# EasyEDA Pro project ProjectFile.epro

# Schematic Schematic1
Board Name: Board1; Create Date: 2026-05-28; Page Name: P1; Project Name: Compact Devboard; Schematic Name: Schematic1; Update Date: 2026-05-31; Company: EasyEDA.com; Page Size: A4; Version: V1.0
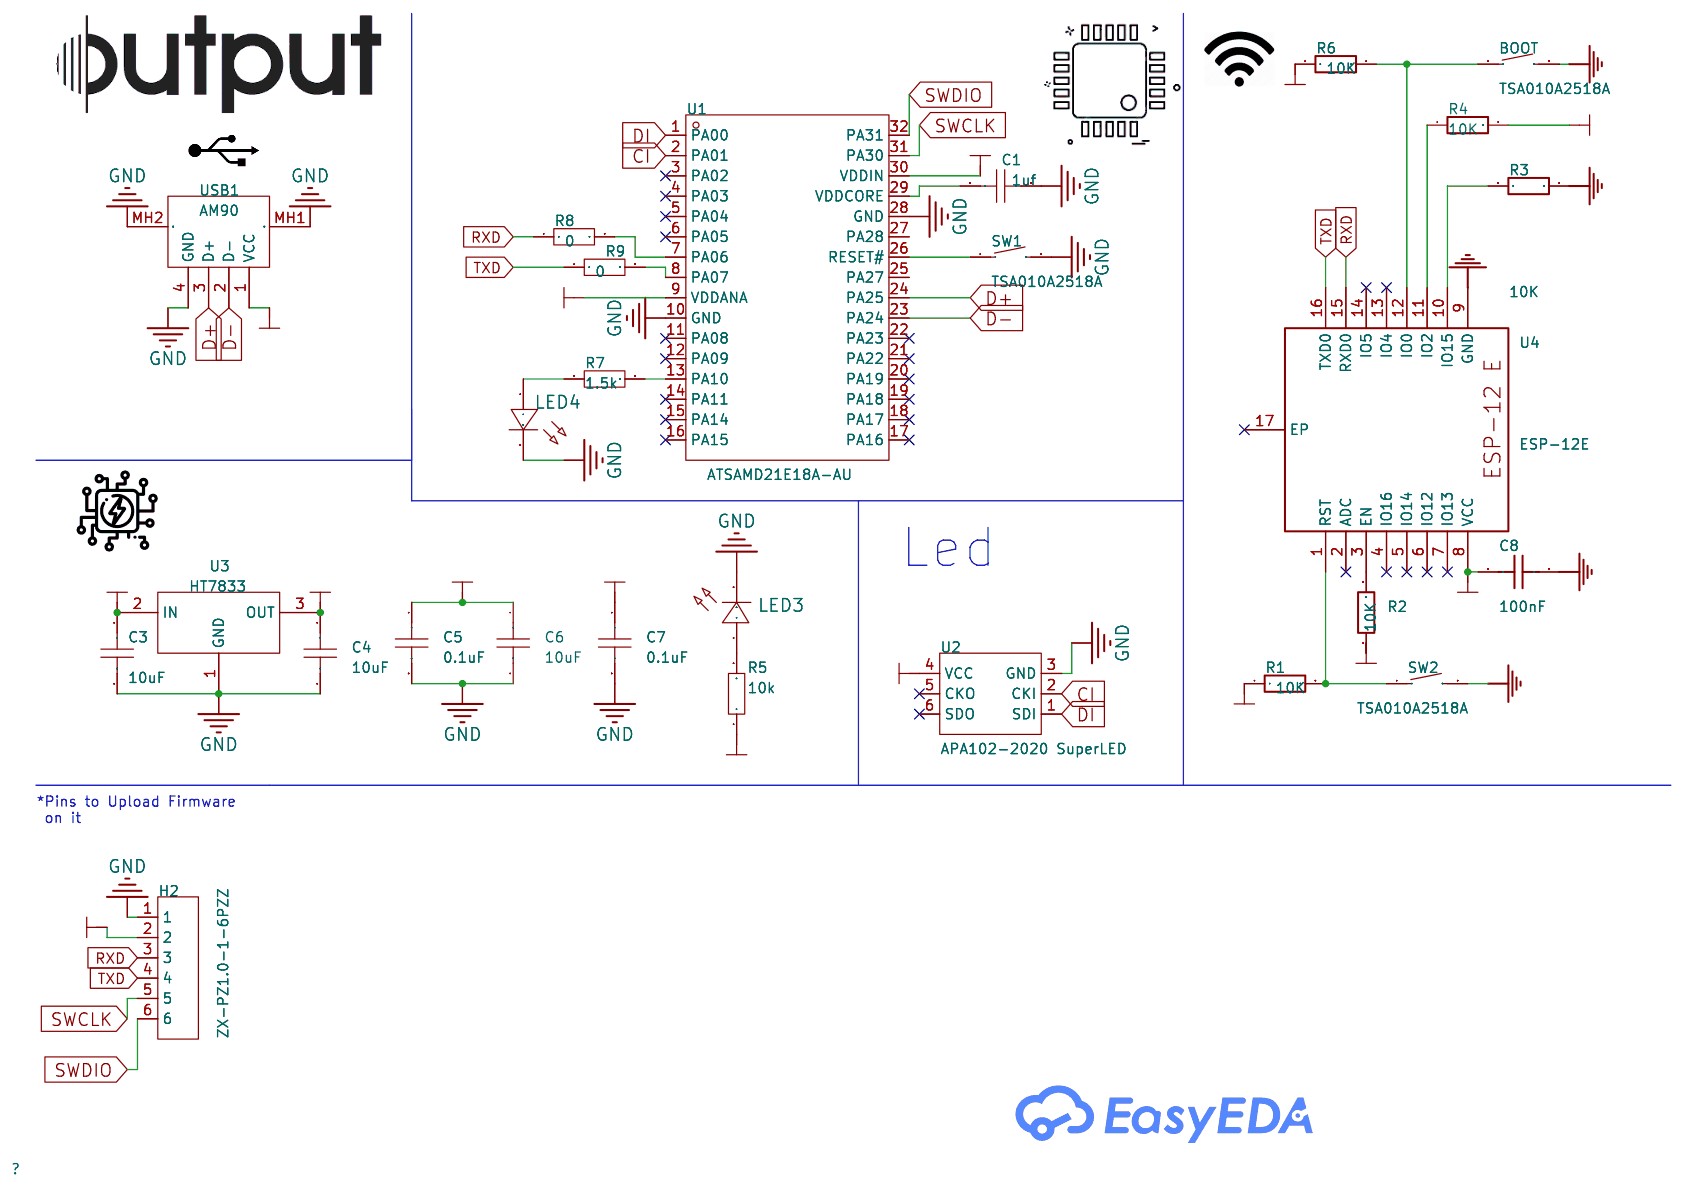
[diagram p0: schematic sheet]

## Parts
BOOT  TSA010A2518A  [SW-SMD_L4.0-W3.0-LS5.0]
C1  1uf  [C0603]
C3  10uF  [C0805]
C4  10uF  [C0805]
C5  0.1uF  [C0805]
C6  10uF  [C0805]
C7  0.1uF  [C0805]
C8  100nF  [C0805]
H2  ZX-PZ1.0-1-6PZZ  [HDR-TH_6P-P1.00-V-F]
LED3  -  [LED0805-RD_GREEN_C0805YGC]
LED4  -  [LED0805-RD_GREEN_C0805YGC]
R1  10K  [R0805]
R2  10K  [R0805]
R3  10K  [R0805]
R4  10K  [R0805]
R5  10k  [R0805_NEW]
R6  10K  [R0805]
R7  1.5k  [R0805_NEW]
R8  0  [R0603]
R9  0  [R0603]
SW1  TSA010A2518A  [SW-SMD_L4.0-W3.0-LS5.0]
SW2  TSA010A2518A  [SW-SMD_L4.0-W3.0-LS5.0]
U1  ATSAMD21E18A-AU  [TQFP-32_L7.0-W7.0-P0.80-LS9.0-BL]
U2  APA102-2020 SuperLED  [LED-SMD_6P-L2.0-W2.0-APA102-2020-SUPERLED]
U3  HT7833  [SOT-89_L4.5-W2.5-P1.50-LS4.2-BR]
U4  ESP-12E  [WIRELM-SMD_ESP-12S]
USB1  AM90  [USB-AM-TH_AM90]

## Library data of the parts
BOOT SW1 SW2 = TSA010A2518A: Actuator Style:Round Button Operating Force:1.8N Mounting Type:Surface Mount,Vertical Length:3.9mm Width:3mm Switch Height:2.5mm Contact Current:50mA Voltage Rating:12V Life:-; LCSC Part Name: 3*4*2.5H-J 180gf 双弹平脚; Supplier Part: C2888945; Manufacturer: BZCN(博众电气); Supplier Footprint: SMD,3.9x3mm; JLCPCB Part Class: Extended Part; Datasheet: https://item.szlcsc.com/datasheet/TSA010A2518A/3109348.html; Supplier: LCSC; Actuator Style: Round Button; Operating Force: 1.8N; Mounting Type: Surface Mount,Vertical; Length: 3.9mm; Width: 3mm; Switch Height: 2.5mm; Contact Current: 50mA; Voltage Rating: 12V
C1 C3-C7 = CAP_0603: Supplier Footprint: 0603
C8 = 100nF: Supplier: LCSC; Supplier Part: C141183; Manufacturer: KEMET; Manufacturer Part: C1206C104K1RAC7800; nameAlias: Capacitance; Contributor: LCSC; spicePre: C; spiceSymbolName: C1206C104K1RAC7800
H2 = ZX-PZ1.0-1-6PZZ: Pin Structure:1x6P Pitch:1mm Row Spacing:- Circluar Pins/Square Pins:Pin Header Mounting Type:Through Hole Number of Rows:1 Number of Pins:6P Current Rating:750mA Voltage Rating (Max):- Length of Mating Pin:2mm Insulation Height:1mm Length of End Connecti; LCSC Part Name: 1x6P 间距:1mm 方针 直插; Supplier Part: C37328856; Manufacturer: Megastar(兆星); Supplier Footprint: 插件,P=1mm; Datasheet: https://atta.szlcsc.com/upload/public/pdf/source/20240812/85F48A99F7C6AED78605DAA33CDE8A90.pdf; Supplier: LCSC; Pin Structure: 1x6P; Pitch: 1mm; Circluar Pins/Square Pins: Pin Header; Mounting Type: Through Hole; Number of Rows: 1; Number of Pins: 6P; Current Rating: 750mA; Length of Mating Pin: 2mm; Insulation Height: 1mm; Length of End Connection Pin: 2mm; Contact Material: Brass; Contact Plating: Gold; Operating Temperature: -40℃~+105℃; Color: Black
LED3 LED4 = LED_0402-R: Supplier Footprint: 0402
R1-R4 R6 = 10K: Supplier: LCSC; Supplier Part: C328436; Manufacturer: ResistorToday; Manufacturer Part: PTFR0805B10K0N9; nameAlias: Resistance (Ohms); Contributor: LCSC; spicePre: R; spiceSymbolName: PTFR0805B10K0N9
R5 R7-R9 = Res_0603: Supplier Footprint: 0603
U1 = ATSAMD21E18A-AU: CPU Core:ARM Cortex-M Series CPU Maximum Speed:48MHz Program Storage Size:256KB Number of I/O:26 ADC (Bit):12bit DAC (Bit):10bit Voltage - Supply:1.62V~3.6V Voltage - Supply:1.62V~3.6V Applications:-; LCSC Part Name: 低功耗、带先进模拟电路和PWM的32位Cortex-M0+微控制器; Supplier Part: C618771; Manufacturer: MICROCHIP(美国微芯); Supplier Footprint: TQFP-32(7x7); JLCPCB Part Class: Extended Part; Datasheet: https://item.szlcsc.com/datasheet/ATSAMD21E18A-AU/648612.html; Supplier: LCSC; CPU Core: ARM Cortex-M Series; CPU Maximum Speed: 48MHz; Program Storage Size: 256KB; Number of I/O: 26; ADC (Bit): 12bit; DAC (Bit): 10bit; Voltage - Supply: 1.62V~3.6V
U2 = APA102-2020 SuperLED: Supplier Part: C22439302; Manufacturer: Led-Color(色彩光电); Supplier Footprint: SMD-6P,2x2mm; JLCPCB Part Class: Extended Part; Datasheet: https://item.szlcsc.com/datasheet/APA102-2020%2520SuperLED/24082914.html; Supplier: LCSC
U3 = HT7833_C50936: +3V; LCSC Part Name: +3V; Supplier Part: C50936; Manufacturer: HOLTEK(合泰/盛群); Supplier Footprint: SOT-89-3; JLCPCB Part Class: Extended Part; Supplier: LCSC; Output Type: Fixed; Voltage - Supply: 8V; Output Voltage: +3V; Output Current: 500mA; Voltage Dropout: 500mV@(500mA); standby current: 7uA; Features: Over Current Protection；Over Temperature Protection; Operating Temperature: -40℃~+85℃@(Ta); Output Configuration: Positive; Number of Outputs: 1
U4 = ESP-12E: Supplier: LCSC; Manufacturer: Ai-Thinker; Manufacturer Part: ESP-12S; Supplier Part: C82898; JLCPCB Part Class: Extend; Contributor: LCSC; LCSC Assembly: Yes; spicePre: U; spiceSymbolName: ESP-12S
USB1 = AM90: Connector Type:Type-A Protocol Standard:USB 2.0 Gender:Male Mounting Type:Right Angle Number of Contacts:4P Number of Ports:1 Current Rating-Power:1.5A Voltage Rating:30V Connect-Disconnect Life:5,000 times Supplementary Features:- Center Height:- Length:; LCSC Part Name: Type-A弯插公头; Supplier Part: C404965; Manufacturer: SHOU HAN(首韩); Supplier Footprint: 弯插; JLCPCB Part Class: Extended Part; Datasheet: https://item.szlcsc.com/datasheet/AM90/392530.html; Supplier: LCSC; Connector Type: Type-A; Protocol Standard: USB 2.0; Gender: Male; Mounting Type: Right Angle; Number of Contacts: 4P; Number of Ports: 1; Current Rating-Power: 1.5A; Voltage Rating: 30V; Connect-Disconnect Life: 5,000 times; Length: 18.8mm; Detection color: White; Operating Temperature: -25℃~+85℃

## Nets
+3V: C4.1 C8.2 H2.2 R1.1 R2.1 R4.2 R5.1 R6.2 U1.9(VDDANA) U1.30(VDDIN) U2.4(VCC) U3.3(OUT) U4.8(VCC)
GND: BOOT.2 C1.1 C3.2 C4.2 C5.2 C6.2 C7.2 C8.1 H2.1 LED3.2(C) LED4.2(C) R3.1 SW1.2 SW2.2 U1.10(GND) U1.28(GND) U2.3(GND) U3.1(GND) U4.9(GND) USB1.4(GND) USB1.MH1 USB1.MH2
VBUS: C3.1 C5.1 C6.1 C7.1 U3.2(IN) USB1.1(VCC)
CI: U1.2(PA01) U2.2(CKI)
D+: U1.24(PA25) USB1.3(D+)
D-: U1.23(PA24) USB1.2(D-)
DI: U1.1(PA00) U2.1(SDI)
RXD: H2.3 R8.1 U4.15(RXD0)
SWCLK: H2.5 U1.31(PA30)
SWDIO: H2.6 U1.32(PA31)
TXD: H2.4 R9.1 U4.16(TXD0)
$1N870: SW1.1 U1.26(RESET#)
$1N975: C1.2 U1.29(VDDCORE)
$1N1579: LED3.1(A) R5.2
$1N2156: R4.1 U4.11(IO2)
$1N2157: R2.2 U4.3(EN)
$1N2159: R1.2 SW2.1 U4.1(RST)
$1N2166: BOOT.1 R6.1 U4.12(IO0)
$1N2167: R3.2 U4.10(IO15)
$1N2700: R8.2 U1.7(PA06)
$1N2731: R9.2 U1.8(PA07)
$1N3467: LED4.1(A) R7.1
$1N3470: R7.2 U1.13(PA10)

Not connected (* = marked no-connect by the designer): U1 3(PA02)* 4(PA03)* 5(PA04)* 6(PA05)* 11(PA08)* 12(PA09)* 14(PA11)* 15(PA14)* 16(PA15)* 17(PA16)* 18(PA17)* 19(PA18)* 20(PA19)* 21(PA22)* 22(PA23)* 25(PA27) 27(PA28); U2 5(CKO)* 6(SDO)*; U4 2(ADC)* 4(IO16)* 5(IO14)* 6(IO12)* 7(IO13)* 13(IO4)* 14(IO5)* 17(EP)*

## Notes on the sheet
- Led
- *Pins to Upload Firmware
   on it
